# Altium schematic sheet 13_FPGA_banks_5A_5B_6A.SchDoc: FPGA banks 5A, 5B, 6A
size A3; Organization: Lime Microsystems; Address1: Surrey Tech Centre; Address2: Guildford GU2 7YG; Address3: Surrey; Address4: United Kingdom; Revision: v1.2; SheetNumber: 11; SheetTotal: 27
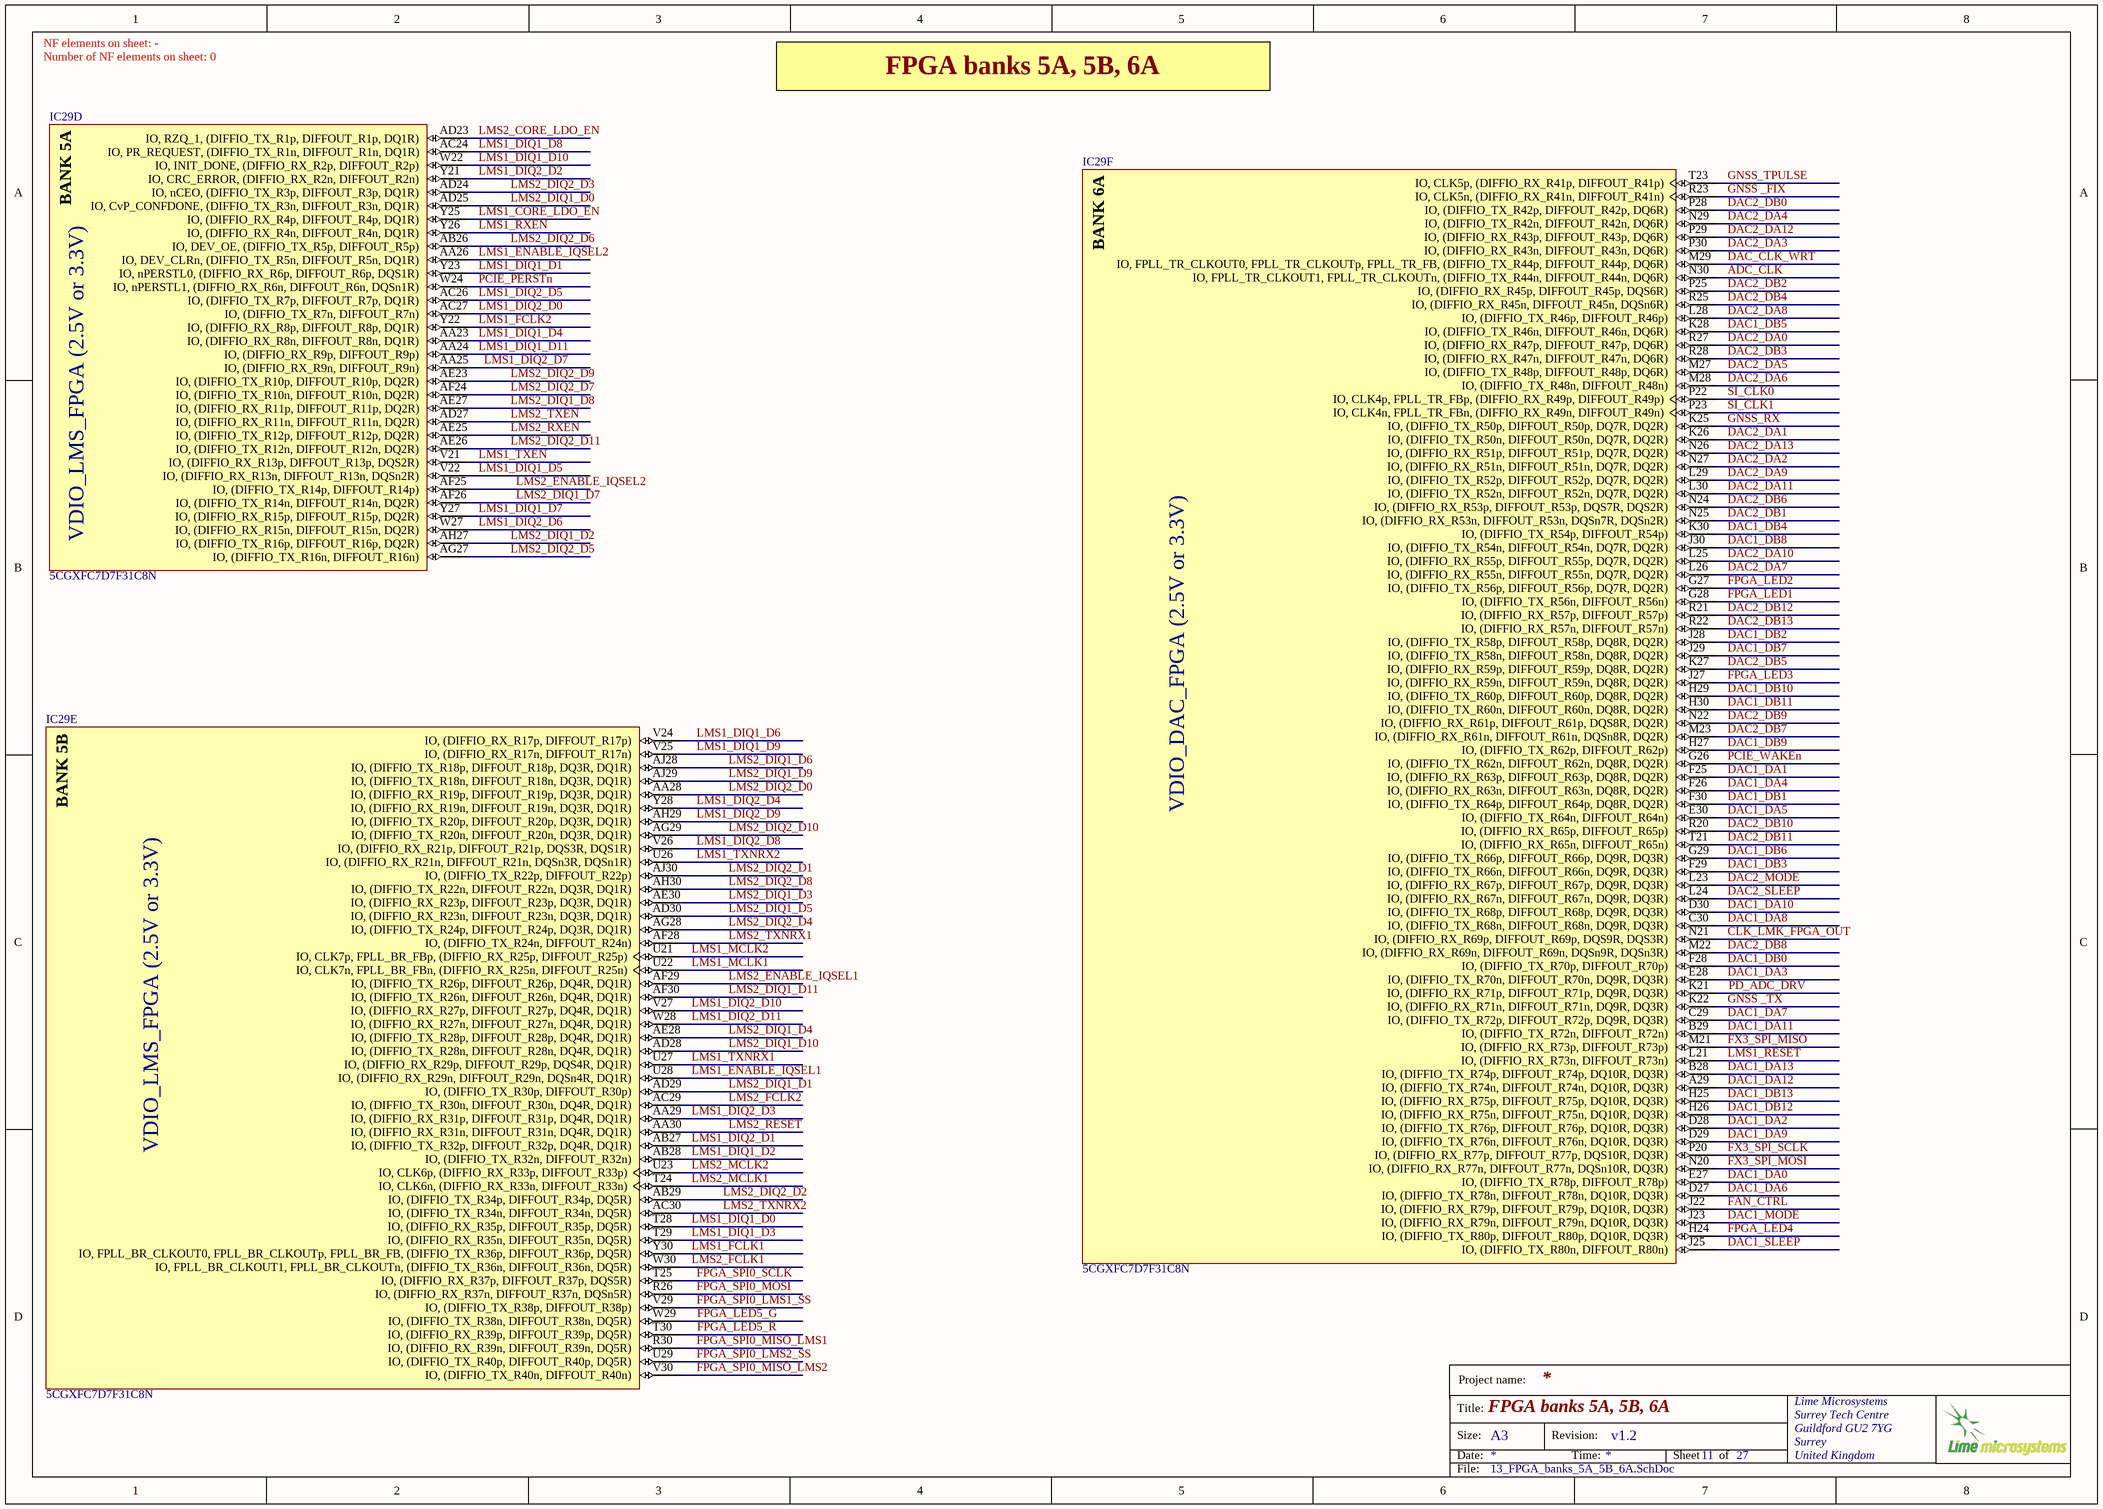
[diagram p0: 13_FPGA_banks_5A_5B_6A.SchDoc]

## Parts
IC29  5CGXFC7D7F31C8N  [ALTR-FBGA896_A-200]  (parts D,E,F of 16)

## Nets
ADC_CLK: IC29.N30(IO,_FPLL_TR_CLKOUT1,_FPLL_TR_CLKOUTn,_(DIFFIO_TX_R44n,_DIFFOUT_R44n,_DQ6R))
CLK_LMK_FPGA_OUT: IC29.N21(IO,_(DIFFIO_RX_R69p,_DIFFOUT_R69p,_DQS9R,_DQS3R))
DAC1_DA0: IC29.E27(IO,_(DIFFIO_TX_R78p,_DIFFOUT_R78p))
DAC1_DA1: IC29.F25(IO,_(DIFFIO_RX_R63p,_DIFFOUT_R63p,_DQ8R,_DQ2R))
DAC1_DA2: IC29.D28(IO,_(DIFFIO_TX_R76p,_DIFFOUT_R76p,_DQ10R,_DQ3R))
DAC1_DA3: IC29.E28(IO,_(DIFFIO_TX_R70n,_DIFFOUT_R70n,_DQ9R,_DQ3R))
DAC1_DA4: IC29.F26(IO,_(DIFFIO_RX_R63n,_DIFFOUT_R63n,_DQ8R,_DQ2R))
DAC1_DA5: IC29.E30(IO,_(DIFFIO_TX_R64n,_DIFFOUT_R64n))
DAC1_DA6: IC29.D27(IO,_(DIFFIO_TX_R78n,_DIFFOUT_R78n,_DQ10R,_DQ3R))
DAC1_DA7: IC29.C29(IO,_(DIFFIO_TX_R72p,_DIFFOUT_R72p,_DQ9R,_DQ3R))
DAC1_DA8: IC29.C30(IO,_(DIFFIO_TX_R68n,_DIFFOUT_R68n,_DQ9R,_DQ3R))
DAC1_DA9: IC29.D29(IO,_(DIFFIO_TX_R76n,_DIFFOUT_R76n,_DQ10R,_DQ3R))
DAC1_DA10: IC29.D30(IO,_(DIFFIO_TX_R68p,_DIFFOUT_R68p,_DQ9R,_DQ3R))
DAC1_DA11: IC29.B29(IO,_(DIFFIO_TX_R72n,_DIFFOUT_R72n))
DAC1_DA12: IC29.A29(IO,_(DIFFIO_TX_R74n,_DIFFOUT_R74n,_DQ10R,_DQ3R))
DAC1_DA13: IC29.B28(IO,_(DIFFIO_TX_R74p,_DIFFOUT_R74p,_DQ10R,_DQ3R))
DAC1_DB0: IC29.F28(IO,_(DIFFIO_TX_R70p,_DIFFOUT_R70p))
DAC1_DB1: IC29.F30(IO,_(DIFFIO_TX_R64p,_DIFFOUT_R64p,_DQ8R,_DQ2R))
DAC1_DB2: IC29.J28(IO,_(DIFFIO_TX_R58p,_DIFFOUT_R58p,_DQ8R,_DQ2R))
DAC1_DB3: IC29.F29(IO,_(DIFFIO_TX_R66n,_DIFFOUT_R66n,_DQ9R,_DQ3R))
DAC1_DB4: IC29.K30(IO,_(DIFFIO_TX_R54p,_DIFFOUT_R54p))
DAC1_DB5: IC29.K28(IO,_(DIFFIO_TX_R46n,_DIFFOUT_R46n,_DQ6R))
DAC1_DB6: IC29.G29(IO,_(DIFFIO_TX_R66p,_DIFFOUT_R66p,_DQ9R,_DQ3R))
DAC1_DB7: IC29.J29(IO,_(DIFFIO_TX_R58n,_DIFFOUT_R58n,_DQ8R,_DQ2R))
DAC1_DB8: IC29.J30(IO,_(DIFFIO_TX_R54n,_DIFFOUT_R54n,_DQ7R,_DQ2R))
DAC1_DB9: IC29.H27(IO,_(DIFFIO_TX_R62p,_DIFFOUT_R62p))
DAC1_DB10: IC29.H29(IO,_(DIFFIO_TX_R60p,_DIFFOUT_R60p,_DQ8R,_DQ2R))
DAC1_DB11: IC29.H30(IO,_(DIFFIO_TX_R60n,_DIFFOUT_R60n,_DQ8R,_DQ2R))
DAC1_DB12: IC29.H26(IO,_(DIFFIO_RX_R75n,_DIFFOUT_R75n,_DQ10R,_DQ3R))
DAC1_DB13: IC29.H25(IO,_(DIFFIO_RX_R75p,_DIFFOUT_R75p,_DQ10R,_DQ3R))
DAC1_MODE: IC29.J23(IO,_(DIFFIO_RX_R79n,_DIFFOUT_R79n,_DQ10R,_DQ3R))
DAC1_SLEEP: IC29.J25(IO,_(DIFFIO_TX_R80n,_DIFFOUT_R80n))
DAC2_DA0: IC29.R27(IO,_(DIFFIO_RX_R47p,_DIFFOUT_R47p,_DQ6R))
DAC2_DA1: IC29.K26(IO,_(DIFFIO_TX_R50n,_DIFFOUT_R50n,_DQ7R,_DQ2R))
DAC2_DA2: IC29.N27(IO,_(DIFFIO_RX_R51n,_DIFFOUT_R51n,_DQ7R,_DQ2R))
DAC2_DA3: IC29.P30(IO,_(DIFFIO_RX_R43n,_DIFFOUT_R43n,_DQ6R))
DAC2_DA4: IC29.N29(IO,_(DIFFIO_TX_R42n,_DIFFOUT_R42n,_DQ6R))
DAC2_DA5: IC29.M27(IO,_(DIFFIO_TX_R48p,_DIFFOUT_R48p,_DQ6R))
DAC2_DA6: IC29.M28(IO,_(DIFFIO_TX_R48n,_DIFFOUT_R48n))
DAC2_DA7: IC29.L26(IO,_(DIFFIO_RX_R55n,_DIFFOUT_R55n,_DQ7R,_DQ2R))
DAC2_DA8: IC29.L28(IO,_(DIFFIO_TX_R46p,_DIFFOUT_R46p))
DAC2_DA9: IC29.L29(IO,_(DIFFIO_TX_R52p,_DIFFOUT_R52p,_DQ7R,_DQ2R))
DAC2_DA10: IC29.L25(IO,_(DIFFIO_RX_R55p,_DIFFOUT_R55p,_DQ7R,_DQ2R))
DAC2_DA11: IC29.L30(IO,_(DIFFIO_TX_R52n,_DIFFOUT_R52n,_DQ7R,_DQ2R))
DAC2_DA12: IC29.P29(IO,_(DIFFIO_RX_R43p,_DIFFOUT_R43p,_DQ6R))
DAC2_DA13: IC29.N26(IO,_(DIFFIO_RX_R51p,_DIFFOUT_R51p,_DQ7R,_DQ2R))
DAC2_DB0: IC29.P28(IO,_(DIFFIO_TX_R42p,_DIFFOUT_R42p,_DQ6R))
DAC2_DB1: IC29.N25(IO,_(DIFFIO_RX_R53n,_DIFFOUT_R53n,_DQSn7R,_DQSn2R))
DAC2_DB2: IC29.P25(IO,_(DIFFIO_RX_R45p,_DIFFOUT_R45p,_DQS6R))
DAC2_DB3: IC29.R28(IO,_(DIFFIO_RX_R47n,_DIFFOUT_R47n,_DQ6R))
DAC2_DB4: IC29.R25(IO,_(DIFFIO_RX_R45n,_DIFFOUT_R45n,_DQSn6R))
DAC2_DB5: IC29.K27(IO,_(DIFFIO_RX_R59p,_DIFFOUT_R59p,_DQ8R,_DQ2R))
DAC2_DB6: IC29.N24(IO,_(DIFFIO_RX_R53p,_DIFFOUT_R53p,_DQS7R,_DQS2R))
DAC2_DB7: IC29.M23(IO,_(DIFFIO_RX_R61n,_DIFFOUT_R61n,_DQSn8R,_DQ2R))
DAC2_DB8: IC29.M22(IO,_(DIFFIO_RX_R69n,_DIFFOUT_R69n,_DQSn9R,_DQSn3R))
DAC2_DB9: IC29.N22(IO,_(DIFFIO_RX_R61p,_DIFFOUT_R61p,_DQS8R,_DQ2R))
DAC2_DB10: IC29.R20(IO,_(DIFFIO_RX_R65p,_DIFFOUT_R65p))
DAC2_DB11: IC29.T21(IO,_(DIFFIO_RX_R65n,_DIFFOUT_R65n))
DAC2_DB12: IC29.R21(IO,_(DIFFIO_RX_R57p,_DIFFOUT_R57p))
DAC2_DB13: IC29.R22(IO,_(DIFFIO_RX_R57n,_DIFFOUT_R57n))
DAC2_MODE: IC29.L23(IO,_(DIFFIO_RX_R67p,_DIFFOUT_R67p,_DQ9R,_DQ3R))
DAC2_SLEEP: IC29.L24(IO,_(DIFFIO_RX_R67n,_DIFFOUT_R67n,_DQ9R,_DQ3R))
DAC_CLK_WRT: IC29.M29(IO,_FPLL_TR_CLKOUT0,_FPLL_TR_CLKOUTp,_FPLL_TR_FB,_(DIFFIO_TX_R44p,_DIFFOUT_R44p,_DQ6R))
FAN_CTRL: IC29.J22(IO,_(DIFFIO_RX_R79p,_DIFFOUT_R79p,_DQ10R,_DQ3R))
FPGA_LED1: IC29.G28(IO,_(DIFFIO_TX_R56n,_DIFFOUT_R56n))
FPGA_LED2: IC29.G27(IO,_(DIFFIO_TX_R56p,_DIFFOUT_R56p,_DQ7R,_DQ2R))
FPGA_LED3: IC29.J27(IO,_(DIFFIO_RX_R59n,_DIFFOUT_R59n,_DQ8R,_DQ2R))
FPGA_LED4: IC29.H24(IO,_(DIFFIO_TX_R80p,_DIFFOUT_R80p,_DQ10R,_DQ3R))
FPGA_LED5_G: IC29.W29(IO,_(DIFFIO_TX_R38n,_DIFFOUT_R38n,_DQ5R))
FPGA_LED5_R: IC29.T30(IO,_(DIFFIO_RX_R39p,_DIFFOUT_R39p,_DQ5R))
FPGA_SPI0_LMS1_SS: IC29.V29(IO,_(DIFFIO_TX_R38p,_DIFFOUT_R38p))
FPGA_SPI0_LMS2_SS: IC29.U29(IO,_(DIFFIO_TX_R40p,_DIFFOUT_R40p,_DQ5R))
FPGA_SPI0_MISO_LMS1: IC29.R30(IO,_(DIFFIO_RX_R39n,_DIFFOUT_R39n,_DQ5R))
FPGA_SPI0_MISO_LMS2: IC29.V30(IO,_(DIFFIO_TX_R40n,_DIFFOUT_R40n))
FPGA_SPI0_MOSI: IC29.R26(IO,_(DIFFIO_RX_R37n,_DIFFOUT_R37n,_DQSn5R))
FPGA_SPI0_SCLK: IC29.T25(IO,_(DIFFIO_RX_R37p,_DIFFOUT_R37p,_DQS5R))
FX3_SPI_MISO: IC29.M21(IO,_(DIFFIO_RX_R73p,_DIFFOUT_R73p))
FX3_SPI_MOSI: IC29.N20(IO,_(DIFFIO_RX_R77n,_DIFFOUT_R77n,_DQSn10R,_DQ3R))
FX3_SPI_SCLK: IC29.P20(IO,_(DIFFIO_RX_R77p,_DIFFOUT_R77p,_DQS10R,_DQ3R))
GNSS _FIX: IC29.R23(IO,_CLK5n,_(DIFFIO_RX_R41n,_DIFFOUT_R41n))
GNSS _TX: IC29.K22(IO,_(DIFFIO_RX_R71n,_DIFFOUT_R71n,_DQ9R,_DQ3R))
GNSS_RX: IC29.K25(IO,_(DIFFIO_TX_R50p,_DIFFOUT_R50p,_DQ7R,_DQ2R))
GNSS_TPULSE: IC29.T23(IO,_CLK5p,_(DIFFIO_RX_R41p,_DIFFOUT_R41p))
LMS1_CORE_LDO_EN: IC29.Y25(IO,_(DIFFIO_RX_R4p,_DIFFOUT_R4p,_DQ1R))
LMS1_DIQ1_D0: IC29.T28(IO,_(DIFFIO_RX_R35p,_DIFFOUT_R35p,_DQ5R))
LMS1_DIQ1_D1: IC29.Y23(IO,_nPERSTL0,_(DIFFIO_RX_R6p,_DIFFOUT_R6p,_DQS1R))
LMS1_DIQ1_D2: IC29.AB28(IO,_(DIFFIO_TX_R32n,_DIFFOUT_R32n))
LMS1_DIQ1_D3: IC29.T29(IO,_(DIFFIO_RX_R35n,_DIFFOUT_R35n,_DQ5R))
LMS1_DIQ1_D4: IC29.AA23(IO,_(DIFFIO_RX_R8n,_DIFFOUT_R8n,_DQ1R))
LMS1_DIQ1_D5: IC29.V22(IO,_(DIFFIO_RX_R13n,_DIFFOUT_R13n,_DQSn2R))
LMS1_DIQ1_D6: IC29.V24(IO,_(DIFFIO_RX_R17p,_DIFFOUT_R17p))
LMS1_DIQ1_D7: IC29.Y27(IO,_(DIFFIO_RX_R15p,_DIFFOUT_R15p,_DQ2R))
LMS1_DIQ1_D8: IC29.AC24(IO,_PR_REQUEST,_(DIFFIO_TX_R1n,_DIFFOUT_R1n,_DQ1R))
LMS1_DIQ1_D9: IC29.V25(IO,_(DIFFIO_RX_R17n,_DIFFOUT_R17n))
LMS1_DIQ1_D10: IC29.W22(IO,_INIT_DONE,_(DIFFIO_RX_R2p,_DIFFOUT_R2p))
LMS1_DIQ1_D11: IC29.AA24(IO,_(DIFFIO_RX_R9p,_DIFFOUT_R9p))
LMS1_DIQ2_D0: IC29.AC27(IO,_(DIFFIO_TX_R7n,_DIFFOUT_R7n))
LMS1_DIQ2_D1: IC29.AB27(IO,_(DIFFIO_TX_R32p,_DIFFOUT_R32p,_DQ4R,_DQ1R))
LMS1_DIQ2_D2: IC29.Y21(IO,_CRC_ERROR,_(DIFFIO_RX_R2n,_DIFFOUT_R2n))
LMS1_DIQ2_D3: IC29.AA29(IO,_(DIFFIO_RX_R31p,_DIFFOUT_R31p,_DQ4R,_DQ1R))
LMS1_DIQ2_D4: IC29.Y28(IO,_(DIFFIO_RX_R19n,_DIFFOUT_R19n,_DQ3R,_DQ1R))
LMS1_DIQ2_D5: IC29.AC26(IO,_(DIFFIO_TX_R7p,_DIFFOUT_R7p,_DQ1R))
LMS1_DIQ2_D6: IC29.W27(IO,_(DIFFIO_RX_R15n,_DIFFOUT_R15n,_DQ2R))
LMS1_DIQ2_D7: IC29.AA25(IO,_(DIFFIO_RX_R9n,_DIFFOUT_R9n))
LMS1_DIQ2_D8: IC29.V26(IO,_(DIFFIO_RX_R21p,_DIFFOUT_R21p,_DQS3R,_DQS1R))
LMS1_DIQ2_D9: IC29.AH29(IO,_(DIFFIO_TX_R20p,_DIFFOUT_R20p,_DQ3R,_DQ1R))
LMS1_DIQ2_D10: IC29.V27(IO,_(DIFFIO_RX_R27p,_DIFFOUT_R27p,_DQ4R,_DQ1R))
LMS1_DIQ2_D11: IC29.W28(IO,_(DIFFIO_RX_R27n,_DIFFOUT_R27n,_DQ4R,_DQ1R))
LMS1_ENABLE_IQSEL1: IC29.U28(IO,_(DIFFIO_RX_R29n,_DIFFOUT_R29n,_DQSn4R,_DQ1R))
LMS1_ENABLE_IQSEL2: IC29.AA26(IO,_DEV_CLRn,_(DIFFIO_TX_R5n,_DIFFOUT_R5n,_DQ1R))
LMS1_FCLK1: IC29.Y30(IO,_FPLL_BR_CLKOUT0,_FPLL_BR_CLKOUTp,_FPLL_BR_FB,_(DIFFIO_TX_R36p,_DIFFOUT_R36p,_DQ5R))
LMS1_FCLK2: IC29.Y22(IO,_(DIFFIO_RX_R8p,_DIFFOUT_R8p,_DQ1R))
LMS1_MCLK1: IC29.U22(IO,_CLK7n,_FPLL_BR_FBn,_(DIFFIO_RX_R25n,_DIFFOUT_R25n))
LMS1_MCLK2: IC29.U21(IO,_CLK7p,_FPLL_BR_FBp,_(DIFFIO_RX_R25p,_DIFFOUT_R25p))
LMS1_RESET: IC29.L21(IO,_(DIFFIO_RX_R73n,_DIFFOUT_R73n))
LMS1_RXEN: IC29.Y26(IO,_(DIFFIO_RX_R4n,_DIFFOUT_R4n,_DQ1R))
LMS1_TXEN: IC29.V21(IO,_(DIFFIO_RX_R13p,_DIFFOUT_R13p,_DQS2R))
LMS1_TXNRX1: IC29.U27(IO,_(DIFFIO_RX_R29p,_DIFFOUT_R29p,_DQS4R,_DQ1R))
LMS1_TXNRX2: IC29.U26(IO,_(DIFFIO_RX_R21n,_DIFFOUT_R21n,_DQSn3R,_DQSn1R))
LMS2_CORE_LDO_EN: IC29.AD23(IO,_RZQ_1,_(DIFFIO_TX_R1p,_DIFFOUT_R1p,_DQ1R))
LMS2_DIQ1_D0: IC29.AD25(IO,_CvP_CONFDONE,_(DIFFIO_TX_R3n,_DIFFOUT_R3n,_DQ1R))
LMS2_DIQ1_D1: IC29.AD29(IO,_(DIFFIO_TX_R30p,_DIFFOUT_R30p))
LMS2_DIQ1_D2: IC29.AH27(IO,_(DIFFIO_TX_R16p,_DIFFOUT_R16p,_DQ2R))
LMS2_DIQ1_D3: IC29.AE30(IO,_(DIFFIO_RX_R23p,_DIFFOUT_R23p,_DQ3R,_DQ1R))
LMS2_DIQ1_D4: IC29.AE28(IO,_(DIFFIO_TX_R28p,_DIFFOUT_R28p,_DQ4R,_DQ1R))
LMS2_DIQ1_D5: IC29.AD30(IO,_(DIFFIO_RX_R23n,_DIFFOUT_R23n,_DQ3R,_DQ1R))
LMS2_DIQ1_D6: IC29.AJ28(IO,_(DIFFIO_TX_R18p,_DIFFOUT_R18p,_DQ3R,_DQ1R))
LMS2_DIQ1_D7: IC29.AF26(IO,_(DIFFIO_TX_R14n,_DIFFOUT_R14n,_DQ2R))
LMS2_DIQ1_D8: IC29.AE27(IO,_(DIFFIO_RX_R11p,_DIFFOUT_R11p,_DQ2R))
LMS2_DIQ1_D9: IC29.AJ29(IO,_(DIFFIO_TX_R18n,_DIFFOUT_R18n,_DQ3R,_DQ1R))
LMS2_DIQ1_D10: IC29.AD28(IO,_(DIFFIO_TX_R28n,_DIFFOUT_R28n,_DQ4R,_DQ1R))
LMS2_DIQ1_D11: IC29.AF30(IO,_(DIFFIO_TX_R26n,_DIFFOUT_R26n,_DQ4R,_DQ1R))
LMS2_DIQ2_D0: IC29.AA28(IO,_(DIFFIO_RX_R19p,_DIFFOUT_R19p,_DQ3R,_DQ1R))
LMS2_DIQ2_D1: IC29.AJ30(IO,_(DIFFIO_TX_R22p,_DIFFOUT_R22p))
LMS2_DIQ2_D2: IC29.AB29(IO,_(DIFFIO_TX_R34p,_DIFFOUT_R34p,_DQ5R))
LMS2_DIQ2_D3: IC29.AD24(IO,_nCEO,_(DIFFIO_TX_R3p,_DIFFOUT_R3p,_DQ1R))
LMS2_DIQ2_D4: IC29.AG28(IO,_(DIFFIO_TX_R24p,_DIFFOUT_R24p,_DQ3R,_DQ1R))
LMS2_DIQ2_D5: IC29.AG27(IO,_(DIFFIO_TX_R16n,_DIFFOUT_R16n))
LMS2_DIQ2_D6: IC29.AB26(IO,_DEV_OE,_(DIFFIO_TX_R5p,_DIFFOUT_R5p))
LMS2_DIQ2_D7: IC29.AF24(IO,_(DIFFIO_TX_R10n,_DIFFOUT_R10n,_DQ2R))
LMS2_DIQ2_D8: IC29.AH30(IO,_(DIFFIO_TX_R22n,_DIFFOUT_R22n,_DQ3R,_DQ1R))
LMS2_DIQ2_D9: IC29.AE23(IO,_(DIFFIO_TX_R10p,_DIFFOUT_R10p,_DQ2R))
LMS2_DIQ2_D10: IC29.AG29(IO,_(DIFFIO_TX_R20n,_DIFFOUT_R20n,_DQ3R,_DQ1R))
LMS2_DIQ2_D11: IC29.AE26(IO,_(DIFFIO_TX_R12n,_DIFFOUT_R12n,_DQ2R))
LMS2_ENABLE_IQSEL1: IC29.AF29(IO,_(DIFFIO_TX_R26p,_DIFFOUT_R26p,_DQ4R,_DQ1R))
LMS2_ENABLE_IQSEL2: IC29.AF25(IO,_(DIFFIO_TX_R14p,_DIFFOUT_R14p))
LMS2_FCLK1: IC29.W30(IO,_FPLL_BR_CLKOUT1,_FPLL_BR_CLKOUTn,_(DIFFIO_TX_R36n,_DIFFOUT_R36n,_DQ5R))
LMS2_FCLK2: IC29.AC29(IO,_(DIFFIO_TX_R30n,_DIFFOUT_R30n,_DQ4R,_DQ1R))
LMS2_MCLK1: IC29.T24(IO,_CLK6n,_(DIFFIO_RX_R33n,_DIFFOUT_R33n))
LMS2_MCLK2: IC29.U23(IO,_CLK6p,_(DIFFIO_RX_R33p,_DIFFOUT_R33p))
LMS2_RESET: IC29.AA30(IO,_(DIFFIO_RX_R31n,_DIFFOUT_R31n,_DQ4R,_DQ1R))
LMS2_RXEN: IC29.AE25(IO,_(DIFFIO_TX_R12p,_DIFFOUT_R12p,_DQ2R))
LMS2_TXEN: IC29.AD27(IO,_(DIFFIO_RX_R11n,_DIFFOUT_R11n,_DQ2R))
LMS2_TXNRX1: IC29.AF28(IO,_(DIFFIO_TX_R24n,_DIFFOUT_R24n))
LMS2_TXNRX2: IC29.AC30(IO,_(DIFFIO_TX_R34n,_DIFFOUT_R34n,_DQ5R))
PCIE_PERSTn: IC29.W24(IO,_nPERSTL1,_(DIFFIO_RX_R6n,_DIFFOUT_R6n,_DQSn1R))
PCIE_WAKEn: IC29.G26(IO,_(DIFFIO_TX_R62n,_DIFFOUT_R62n,_DQ8R,_DQ2R))
PD_ADC_DRV: IC29.K21(IO,_(DIFFIO_RX_R71p,_DIFFOUT_R71p,_DQ9R,_DQ3R))
SI_CLK0: IC29.P22(IO,_CLK4p,_FPLL_TR_FBp,_(DIFFIO_RX_R49p,_DIFFOUT_R49p))
SI_CLK1: IC29.P23(IO,_CLK4n,_FPLL_TR_FBn,_(DIFFIO_RX_R49n,_DIFFOUT_R49n))

## Notes on the sheet
- NF elements on sheet: -
- Number of NF elements on sheet: 0
- FPGA banks 5A, 5B, 6A
- VDIO_LMS_FPGA (2.5V or 3.3V)
- VDIO_DAC_FPGA (2.5V or 3.3V)
- Project name:
- Title:
- Size:
- Date:
- A3
- Revision:
- Time:
- Sheet
- of
- File:
- (in symbol 5CGXFC7D7F31C8N, part D) BANK 5A
- (in symbol 5CGXFC7D7F31C8N, part E) BANK 5B
- (in symbol 5CGXFC7D7F31C8N, part F) BANK 6A

## Library data of the parts
IC29 = 5CGXFC7D7F31C8N: Cyclone V GX Family FPGA, 1.07 to 1.13 V Supply, 480 I/O Pins, 7 PLLs, 896-Pin FBGA, Speed Grade 8, Commercial Grade, RoHS Compliant; Manufacturer: Altera; Part Description: IC FPGA 480 I/O 896FBGA; GPIO: 480; Logic Elements (LE) (K): 149.5; Speed Grade: 8; DatasheetVersion: Rev. 3.4; PackageVersion: Rev. 2.0, 12/2012; PackageReference: FBGA896_A-200; PackageDescription: 896-Pin FineLine Ball-Grid Array (FBGA), Body 31 x 31 mm, Pitch 1 mm; Supplier 1: Digi-Key; Supplier Part Number 1: 544-2772-ND; Supplier 2: Mouser; Supplier Part Number 2: 989-5CGXFC7D7F31C8N; Device Group: 5CGXFC7; RoHS: RoHS Compliant; Subcategory: Cyclone V GX; Voltage Supply: 1.07 to 1.13 V; NexusDeviceID: 5CGXFC7D7F31C8N; Mounting Technology: Surface Mount; Code_JEDEC: MS-034-AAN-1; PartNumber: 5CGXFC7D7F31C8N; ComponentLink1Description: Manufacturer URL; ComponentLink1URL: http://www.altera.com; ComponentLink2Description: Datasheet; ComponentLink2URL: http://www.altera.com/literature/hb/cyclone-v/cv_51002.pdf; ComponentLink3Description: Package Specification; ComponentLink3URL: http://www.altera.com/devicepackaging/04R00435-01.pdf; ComponentLink4Description: Device Handbook URL; ComponentLink4URL: http://www.altera.com/literature/hb/cyclone-v/cyclone5_handbook.pdf; ComponentLink5Description: Device Pin-Out URL; ComponentLink5URL: http://www.altera.com/literature/dp/cyclone-v/5CGXFC7.xls; ComponentLink6Description: Device Overview URL; ComponentLink6URL: http://www.altera.com/literature/hb/cyclone-v/cv_51001.pdf; ComponentLink7Description: Product URL; ComponentLink7URL: http://www.buyaltera.com/scripts/partsearch.dll?Detail&name=5CGXFC7D7F31C8N-ND